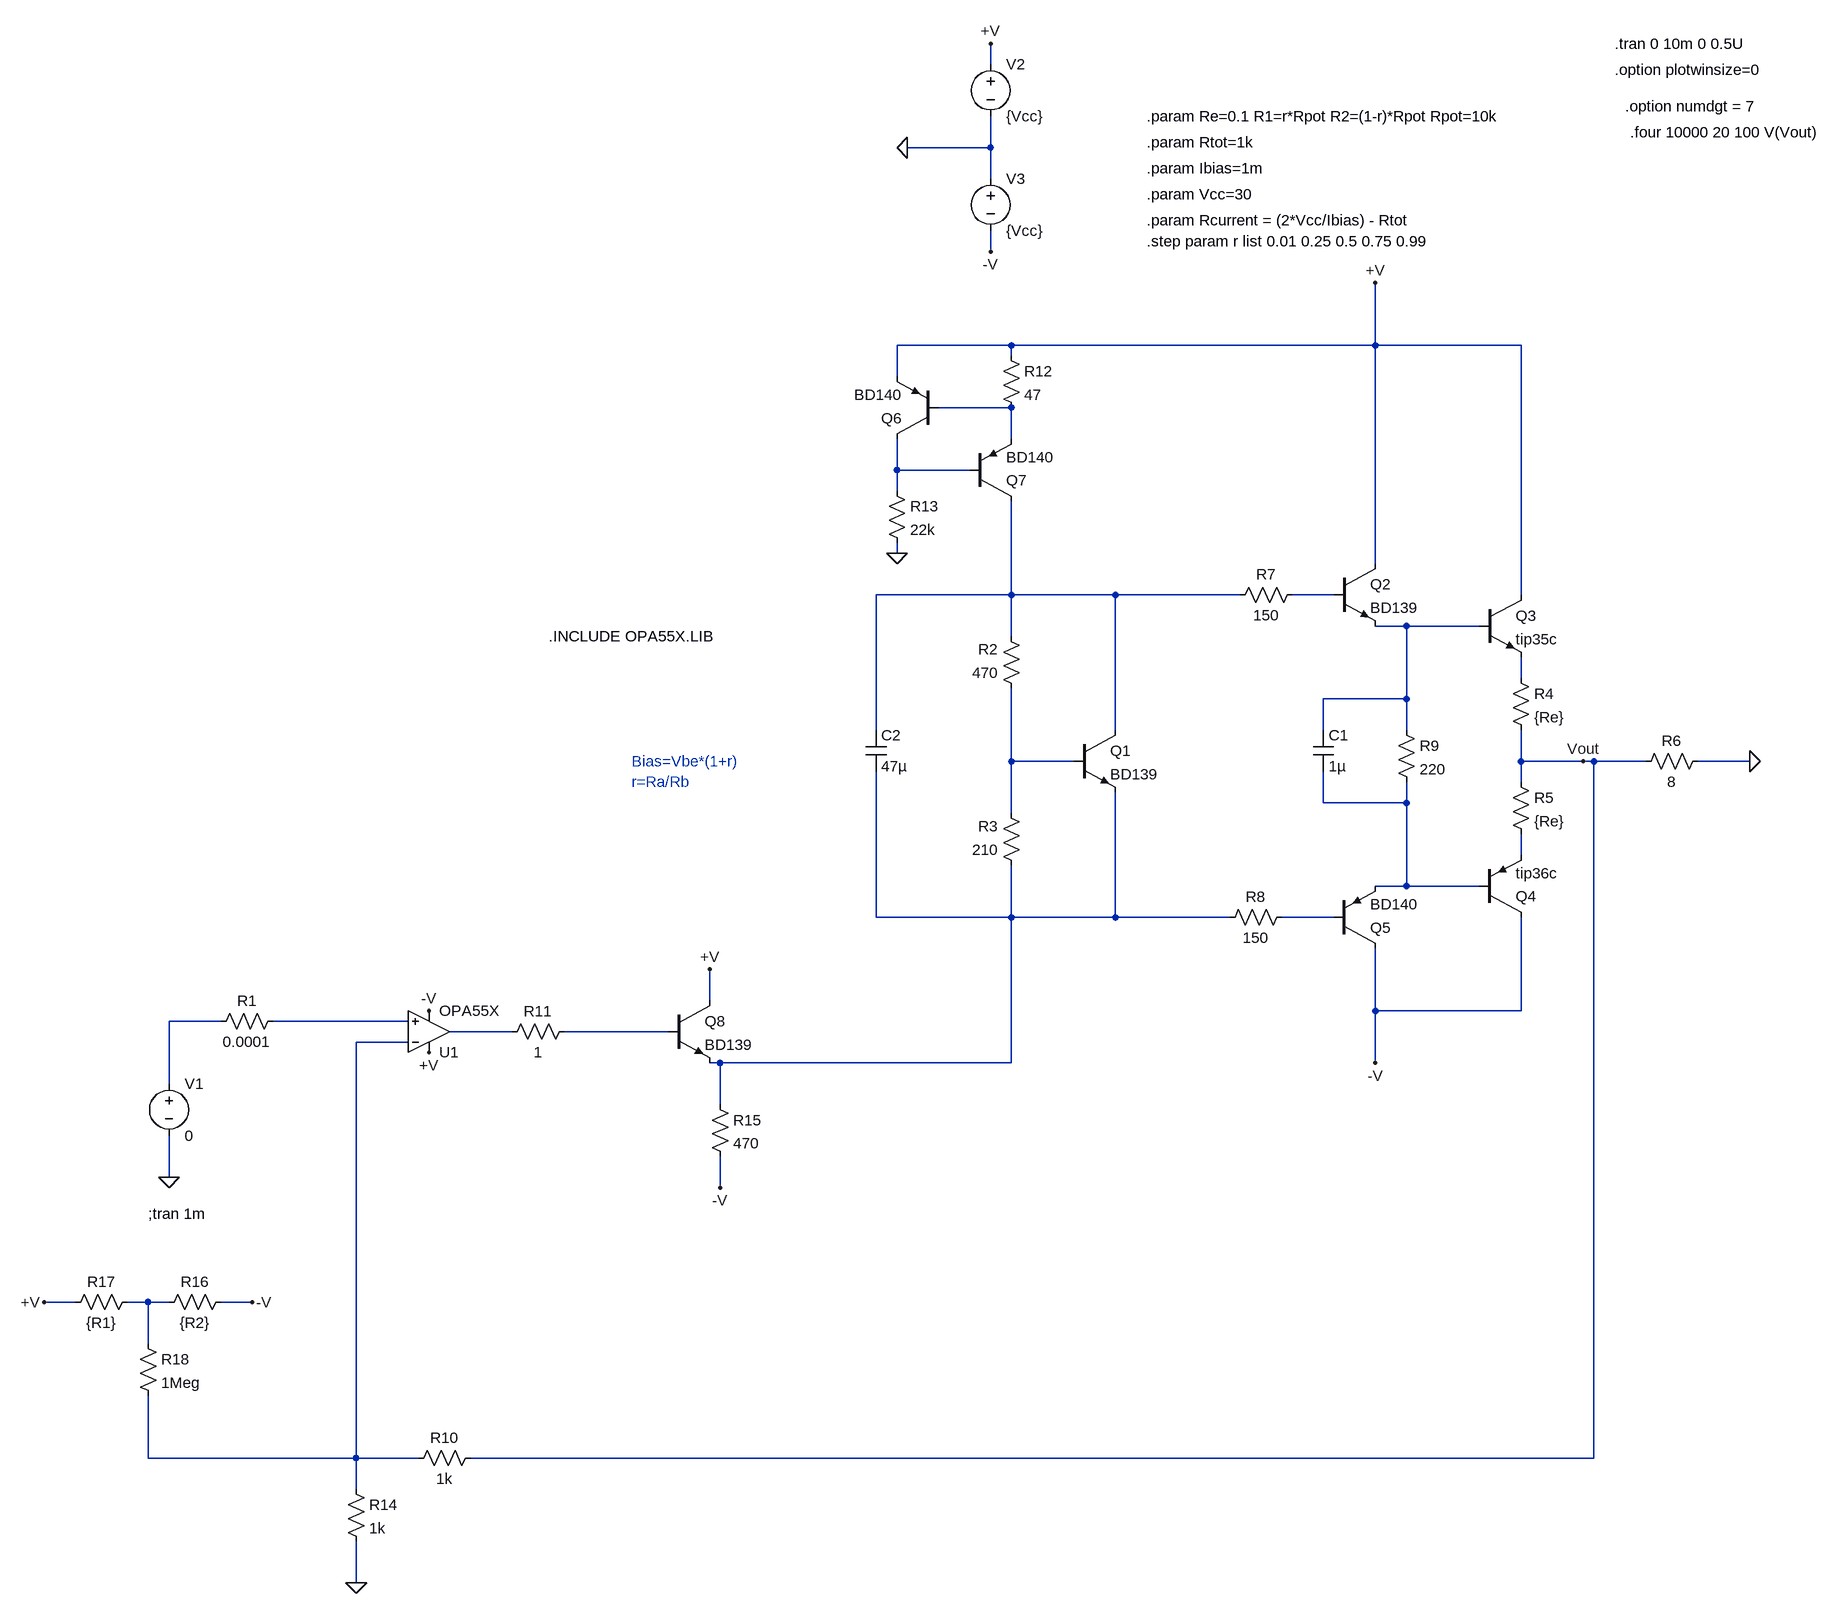
[diagram p0: schematic V3 OFFSET - DC.asc]
V3 OFFSET - DC.asc, the LTspice schematic file:
Version 4
SHEET 1 1208 1316
WIRE -96 -1664 -96 -1696
WIRE -96 -1536 -96 -1584
WIRE -96 -1536 -224 -1536
WIRE -96 -1488 -96 -1536
WIRE -96 -1376 -96 -1408
WIRE -64 -1232 -240 -1232
WIRE 496 -1232 496 -1328
WIRE 496 -1232 -64 -1232
WIRE 720 -1232 496 -1232
WIRE -64 -1216 -64 -1232
WIRE -240 -1184 -240 -1232
WIRE -64 -1136 -176 -1136
WIRE -64 -1088 -64 -1136
WIRE -240 -1040 -240 -1088
WIRE -128 -1040 -240 -1040
WIRE -240 -1008 -240 -1040
WIRE -240 -912 -240 -928
WIRE 496 -896 496 -1232
WIRE -64 -848 -64 -992
WIRE -64 -848 -272 -848
WIRE 96 -848 -64 -848
WIRE 288 -848 96 -848
WIRE 432 -848 368 -848
WIRE 720 -848 720 -1232
WIRE 544 -800 496 -800
WIRE 656 -800 544 -800
WIRE -64 -784 -64 -848
WIRE 720 -720 720 -752
WIRE 544 -688 544 -800
WIRE 544 -688 416 -688
WIRE -272 -640 -272 -848
WIRE 96 -640 96 -848
WIRE 416 -640 416 -688
WIRE 544 -640 544 -688
WIRE -64 -592 -64 -704
WIRE 32 -592 -64 -592
WIRE 720 -592 720 -640
WIRE 816 -592 720 -592
WIRE 832 -592 816 -592
WIRE 912 -592 832 -592
WIRE 1072 -592 992 -592
WIRE 720 -560 720 -592
WIRE 416 -528 416 -576
WIRE 544 -528 544 -560
WIRE 544 -528 416 -528
WIRE -64 -512 -64 -592
WIRE 720 -448 720 -480
WIRE 544 -400 544 -528
WIRE 544 -400 496 -400
WIRE 656 -400 544 -400
WIRE -272 -352 -272 -576
WIRE -64 -352 -64 -432
WIRE -64 -352 -272 -352
WIRE 96 -352 96 -544
WIRE 96 -352 -64 -352
WIRE 272 -352 96 -352
WIRE 432 -352 352 -352
WIRE -528 -224 -528 -272
WIRE 496 -208 496 -304
WIRE 720 -208 720 -352
WIRE 720 -208 496 -208
WIRE -1280 -192 -1360 -192
WIRE -992 -192 -1200 -192
WIRE -832 -176 -928 -176
WIRE -592 -176 -752 -176
WIRE -992 -160 -1072 -160
WIRE -512 -128 -528 -128
WIRE -64 -128 -64 -352
WIRE -64 -128 -512 -128
WIRE 496 -128 496 -208
WIRE -1360 -96 -1360 -192
WIRE -512 -64 -512 -128
WIRE -1360 48 -1360 -16
WIRE -512 64 -512 16
WIRE -1504 240 -1552 240
WIRE -1392 240 -1424 240
WIRE -1360 240 -1392 240
WIRE -1232 240 -1280 240
WIRE -1392 304 -1392 240
WIRE -1392 480 -1392 384
WIRE -1072 480 -1072 -160
WIRE -1072 480 -1392 480
WIRE -976 480 -1072 480
WIRE 832 480 832 -592
WIRE 832 480 -896 480
WIRE -1072 528 -1072 480
WIRE -1072 672 -1072 608
FLAG 496 -1328 +V
FLAG 496 -128 -V
FLAG -1360 48 0
FLAG -224 -1536 0
FLAG -96 -1696 +V
FLAG -96 -1376 -V
FLAG 1072 -592 0
FLAG 816 -592 Vout
FLAG -960 -144 +V
FLAG -960 -208 -V
FLAG -240 -912 0
FLAG -1072 672 0
FLAG -528 -272 +V
FLAG -512 64 -V
FLAG -1552 240 +V
FLAG -1232 240 -V
SYMBOL voltage -1360 -112 R0
WINDOW 123 0 0 Left 0
WINDOW 39 0 0 Left 0
SYMATTR InstName V1
SYMATTR Value 0
SYMBOL res -1184 -208 R90
WINDOW 0 0 56 VBottom 2
WINDOW 3 32 56 VTop 2
SYMATTR InstName R1
SYMATTR Value 0.0001
SYMBOL res -48 -688 R180
WINDOW 0 36 76 Left 2
WINDOW 3 36 40 Left 2
SYMATTR InstName R2
SYMATTR Value 470
SYMBOL res -48 -416 R180
WINDOW 0 36 76 Left 2
WINDOW 3 36 40 Left 2
SYMATTR InstName R3
SYMATTR Value 210
SYMBOL npn 32 -640 R0
SYMATTR InstName Q1
SYMATTR Value BD139
SYMBOL npn 432 -896 R0
SYMATTR InstName Q2
SYMATTR Value BD139
SYMBOL npn 656 -848 R0
SYMATTR InstName Q3
SYMATTR Value tip35c
SYMBOL pnp 656 -352 M180
SYMATTR InstName Q4
SYMATTR Value tip36c
SYMBOL pnp 432 -304 M180
SYMATTR InstName Q5
SYMATTR Value BD140
SYMBOL res 704 -736 R0
SYMATTR InstName R4
SYMATTR Value {Re}
SYMBOL res 704 -576 R0
SYMATTR InstName R5
SYMATTR Value {Re}
SYMBOL voltage -96 -1680 R0
WINDOW 123 0 0 Left 0
WINDOW 39 0 0 Left 0
SYMATTR InstName V2
SYMATTR Value {Vcc}
SYMBOL voltage -96 -1504 R0
WINDOW 123 0 0 Left 0
WINDOW 39 0 0 Left 0
SYMATTR InstName V3
SYMATTR Value {Vcc}
SYMBOL res 1008 -608 R90
WINDOW 0 0 56 VBottom 2
WINDOW 3 32 56 VTop 2
SYMATTR InstName R6
SYMATTR Value 8
SYMBOL res 384 -864 R90
WINDOW 0 0 56 VBottom 2
WINDOW 3 32 56 VTop 2
SYMATTR InstName R7
SYMATTR Value 150
SYMBOL res 368 -368 R90
WINDOW 0 0 56 VBottom 2
WINDOW 3 32 56 VTop 2
SYMATTR InstName R8
SYMATTR Value 150
SYMBOL res 528 -656 R0
SYMATTR InstName R9
SYMATTR Value 220
SYMBOL cap 400 -640 R0
SYMATTR InstName C1
SYMATTR Value 1µ
SYMBOL cap -288 -640 R0
SYMATTR InstName C2
SYMATTR Value 47µ
SYMBOL OpAmps\\opamp2 -960 -112 M180
SYMATTR InstName U1
SYMATTR Value OPA55X
SYMBOL res -880 464 R90
WINDOW 0 0 56 VBottom 2
WINDOW 3 32 56 VTop 2
SYMATTR InstName R10
SYMATTR Value 1k
SYMBOL res -736 -192 R90
WINDOW 0 0 56 VBottom 2
WINDOW 3 32 56 VTop 2
SYMATTR InstName R11
SYMATTR Value 1
SYMBOL pnp -176 -1088 R180
SYMATTR InstName Q6
SYMATTR Value BD140
SYMBOL res -80 -1232 R0
SYMATTR InstName R12
SYMATTR Value 47
SYMBOL pnp -128 -992 M180
SYMATTR InstName Q7
SYMATTR Value BD140
SYMBOL res -256 -1024 R0
SYMATTR InstName R13
SYMATTR Value 22k
SYMBOL res -1088 512 R0
SYMATTR InstName R14
SYMATTR Value 1k
SYMBOL npn -592 -224 R0
SYMATTR InstName Q8
SYMATTR Value BD139
SYMBOL res -528 -80 R0
SYMATTR InstName R15
SYMATTR Value 470
SYMBOL res -1264 224 R90
WINDOW 0 0 56 VBottom 2
WINDOW 3 32 56 VTop 2
SYMATTR InstName R16
SYMATTR Value {R2}
SYMBOL res -1408 224 R90
WINDOW 0 0 56 VBottom 2
WINDOW 3 32 56 VTop 2
SYMATTR InstName R17
SYMATTR Value {R1}
SYMBOL res -1408 288 R0
SYMATTR InstName R18
SYMATTR Value 1Meg
TEXT -648 -592 Left 2 ;Bias=Vbe*(1+r)\nr=Ra/Rb
TEXT 144 -1544 Left 2 !.param Rtot=1k
TEXT 144 -1504 Left 2 !.param Ibias=1m
TEXT 144 -1464 Left 2 !.param Vcc=30
TEXT 144 -1424 Left 2 !.param Rcurrent = (2*Vcc/Ibias) - Rtot
TEXT -1392 104 Left 2 !;tran 1m
TEXT 864 -1696 Left 2 !.tran 0 10m 0 0.5U
TEXT 864 -1656 Left 2 !.option plotwinsize=0
TEXT 880 -1600 Left 2 !.option numdgt = 7
TEXT 888 -1560 Left 2 !.four 10000 20 100 V(Vout)
TEXT -776 -784 Left 2 !.INCLUDE OPA55X.LIB
TEXT 144 -1584 Left 2 !.param Re=0.1 R1=r*Rpot R2=(1-r)*Rpot Rpot=10k
TEXT 144 -1392 Left 2 !.step param r list 0.01 0.25 0.5 0.75 0.99

The netlist it stands for:
* V3 OFFSET - DC.asc
V1 N012 0 0
R1 N013 N012 0.0001
R2 N007 N003 470
R3 N010 N007 210
Q1 N003 N007 N010 0 BD139
Q2 +V N004 N005 0 BD139
Q3 +V N005 N006 0 tip35c
Q4 -V N008 N009 0 tip36c
Q5 -V N011 N008 0 BD140
R4 N006 Vout {Re}
R5 Vout N009 {Re}
V2 +V 0 {Vcc}
V3 0 -V {Vcc}
R6 0 Vout 8
R7 N004 N003 150
R8 N011 N010 150
R9 N005 N008 220
C1 N005 N008 1µ
C2 N003 N010 47µ
XU1 N013 N016 +V -V N014 OPA55X  ; pins In+ In- V+ V- OUT
R10 Vout N016 1k
R11 N015 N014 1
Q6 N002 N001 +V 0 BD140
R12 +V N001 47
Q7 N003 N002 N001 0 BD140
R13 N002 0 22k
R14 N016 0 1k
Q8 +V N015 N010 0 BD139
R15 N010 -V 470
R16 -V N017 {R2}
R17 N017 +V {R1}
R18 N017 N016 1Meg
.model NPN NPN
.model PNP PNP
.lib standard.bjt
* Bias=Vbe*(1+r)
* r=Ra/Rb
.param Rtot=1k
.param Ibias=1m
.param Vcc=30
.param Rcurrent = (2*Vcc/Ibias) - Rtot
;tran 1m
.tran 0 10m 0 0.5U
.option plotwinsize=0
.option numdgt = 7
.four 10000 20 100 V(Vout)
.INCLUDE OPA55X.LIB
.param Re=0.1 R1=r*Rpot R2=(1-r)*Rpot Rpot=10k
.step param r list 0.01 0.25 0.5 0.75 0.99
.backanno
.end